# Altium schematic sheet led_boost.SchDoc
size 292 x 204 mm; ProjectSection: Set ProjectSection in Document Parameters; PageSetup: Record=PageOptions|CenterHorizontal=True|CenterVertical=True|PrintScale=1.00|XCorrection=1.00|YCorrection=1.00|PrintKind=1|BorderSize=5000000|LeftOffset=0|BottomOffset=0|Orientation=2|PaperLength=1000|PaperWidth=1000|Scale=100|PaperSource=7|PrintQuality=1200|MediaType=1|DitherType=10|PaperKind=A4|PrintScaleMode=1
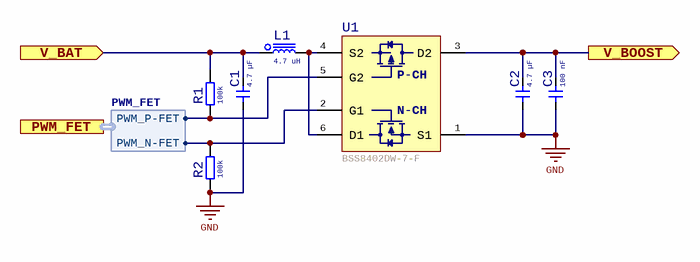
[diagram p0: led_boost.SchDoc]

## Parts
C1  value 4.7 µF  [1608C]  (hidden comment: CAP-NP)
C2  value 4.7 µF  [1608C]  (hidden comment: CAP-NP)
C3  value 100 nF  [1005C]  (hidden comment: CAP-NP)
L1  value 4.7 uH  [2012L]  (hidden comment: INDUCTOR)
R1  value 100k  [1005R]  (hidden comment: RES)
R2  value 100k  [1005R]  (hidden comment: RES)
U1  Manufacturer P/N: BSS8402DW-7-F  [TRANS-DUAL-SOT-363-6]  (hidden comment: TRANS-FET-DUAL-N-P-6PIN)

## Ports
PWM_FET (harness PWM_FET), V_BAT (in), V_BOOST (out)

## Harnesses
PWM_FET: PWM_P-FET, PWM_N-FET

## Nets
GND: C1.1 C2.1 C3.1 R2.1 U1.1(S1)
V_BAT: C1.2 L1.1 R1.2 ; port V_BAT
V_BOOST: C2.2 C3.2 U1.3(D2) ; port V_BOOST
NetL1_2: L1.2 U1.4(S2) U1.6(D1)
NetR1_1: R1.1 U1.5(G2) ; port PWM_FET.PWM_P-FET
NetR2_2: R2.2 U1.2(G1) ; port PWM_FET.PWM_N-FET

## Notes on the sheet
- Project
- Customer
- File Name
- Part
- Section
- Revision (File)
- Variant
- Revision (Project)
- Date
- Sheet
- Contronix GmbH
- Nizzastr. 6, 01445 Radebeul
- (in symbol TRANS-FET-DUAL-N-P-6PIN) P-CH; N-CH

## Library data of the parts
C1 C2 = CAP-4u7-6V3-10%-X5R-1608: SMD ceramic capacitor, X5R; Manufacturer: Kemet; Manufacturer P/N: C0603C475K9PACTU; hasAltManufacturer: 0; Contronix P/N: CVXZ75; autIdem: 255; NozzleType: 701/901; FeederType: Tape 8mm; FeederPitch: 4mm; NumberOfPins: 2; NumberOfRows: 1; Voltage: 6,3; Tolerance: 10%; PackageCNTX: 1608; CapacitanceSI: 4,7E-6; Design Item Id: CAP-4u7-6V3-10%-X5R-1608; Stock: 84; Price: 0,11; Price (€): 0,11; A I: 255; ComponentLink1Description: Manufacturer Datasheet; Supplier 1: Digi-Key; Supplier Part Number 1: 399-3482-1-ND; Created: 08.08.2013 14:56:01; Modified: 18.02.2020 17:38:33; Obsolete: 0; Voltage (V): 6,3; PackageManufacturer: 1608; Material: X5R; MountingType: SMT; polarized: 0; Manufacturer Part Number: C0603C475K9PACTU
C3 = CAP-100n-6V3-10%-X7R-1005: SMD ceramic capacitor, X7R; Manufacturer: Samsung Electro-Mechanics America, Inc.; Manufacturer P/N: CL05B104KQ5NNNC; hasAltManufacturer: 0; Contronix P/N: CANCYL; autIdem: 255; NozzleType: 701/901; FeederType: Tape 8mm; FeederPitch: 2mm; NumberOfPins: 2; NumberOfRows: 1; Voltage: 6,3; Tolerance: 10%; PackageCNTX: 1005; CapacitanceSI: 1E-7; Design Item Id: CAP-100n-6V3-10%-X7R-1005; Stock: 2023; Price: 0,0034; Price (€): 0,0034; A I: 255; ComponentLink1Description: Manufacturer Datasheet; ComponentLink1URL: https://content.kemet.com/datasheets/KEM_C1002_X7R_SMD.pdf; Supplier 1: RS; Supplier Part Number 1: 8015145P; Created: 16.11.2015 10:28:12; Modified: 30.10.2019 13:11:15; Obsolete: 0; Voltage (V): 6,3; PackageManufacturer: 1005; Material: X7R; MountingType: SMT; polarized: 0; Manufacturer Part Number: CL05B104KQ5NNNC
L1 = IND-4u7-0.8A-2012: Chip Inductor; Manufacturer: Murata Electronics; Manufacturer P/N: LQM21PN4R7NGRD; hasAltManufacturer: 0; Contronix P/N: LD7UG2; NozzleType: 711/911; FeederType: Tape 8mm; FeederPitch: 4mm; NumberOfPins: 2; NumberOfRows: 1; PackageCNTX: 2012; InductanceSI: 4,7E-6; Current: 0,8; Tolerance: 30%; Resistance: 0.288; Design Item Id: IND-4u7-0.8A-2012; Stock: 18; Price: 0,106; Price (€): 0,106; ComponentLink1Description: Manufacturer Datasheet; ComponentLink1URL: http://search.murata.co.jp/Ceramy/image/img/P02/JELF243B-0026.pdf; Supplier 1: Digi-Key; Supplier Part Number 1: 490-7782-1-ND; Supplier 2: Mouser; Supplier Part Number 2: 81-LQM21PN4R7NGRDRD; Created: 09.11.2017 14:17:36; Modified: 14.11.2018 11:06:53; Obsolete: 0; PackageManufacturer: 2012; Inductance: 4.7 uH; MountingType: SMT; Manufacturer Part Number: LQM21PN4R7NGRD
R1 R2 = RES-100k-1%-0.063W-1005: SMD resistor; Manufacturer: Yageo; Manufacturer P/N: RC0402FR-07100KL; hasAltManufacturer: 0; Contronix P/N: R4P27U; autIdem: 255; NozzleType: 701/901; FeederType: Tape 8mm; FeederPitch: 2mm; PackageCNTX: 1005; NumberOfPins: 2; NumberOfRows: 1; ResistanceSI: 100000; Tolerance: 1%; Power: 0,063; Design Item Id: RES-100k-1%-0.063W-1005; Stock: 151; Price: 0,09; Price (€): 0,09; A I: 255; ComponentLink1Description: Manufacturer Datasheet; ComponentLink1URL: http://www.seielect.com/Catalog/SEI-RMC.pdf; Supplier 1: Mouser; Supplier Part Number 1: 603-RC0402FR-07100KL; Supplier 2: Digi-Key; Supplier Part Number 2: 311-100KLRCT-ND; Supplier 3: Digi-Key; Supplier Part Number 3: 311-100KLRCT-ND; Modified: 26.06.2020 15:46:35; Obsolete: 0; PackageManufacturer: 1005; Resistance: 100k; MountingType: SMT; Manufacturer Part Number: RC0402FR-07100KL
U1 = TRANS-FET-DUAL-N-P-6PIN: N and P-Channel MOSFET; Manufacturer: Diodes Inc.; hasAltManufacturer: 0; Manufacturer Part Number: DMC2041UFDB; Contronix P/N: QBSP7Z; NozzleType: 711/911; FeederType: Tape 8mm; FeederPitch: 4mm; PackageCNTX: U-DFN2020-6; NumberOfPins: 6; NumberOfRows: 2; Voltage: 20; Current: 4,7; Stratification: P- and N-Channel; Rev: =VersionControl_RevNumber; Design Item Id: TRANS-FET-DUAL-N-P-20V-4.7A-3.2A-DMC2041-DFN2020; Stock: 0; Price: 0,672; Price (€): 0,672; ComponentLink1Description: Manufacturer Datasheet; ComponentLink1URL: https://www.diodes.com/assets/Datasheets/DMC2041UFDB.pdf; Supplier 1: Mouser; Supplier Part Number 1: 621-DMC2041UFDB-7; Supplier 2: Digi-Key; Supplier Part Number 2: DMC2041UFDB-7DICT-ND; Created: 13.02.2018 12:07:42; Modified: 13.09.2019 15:59:32; Obsolete: 0; PackageManufacturer: U-DFN2020-6; Voltage (V): 20; Type: MOSFET Enh.; MountingType: SMT